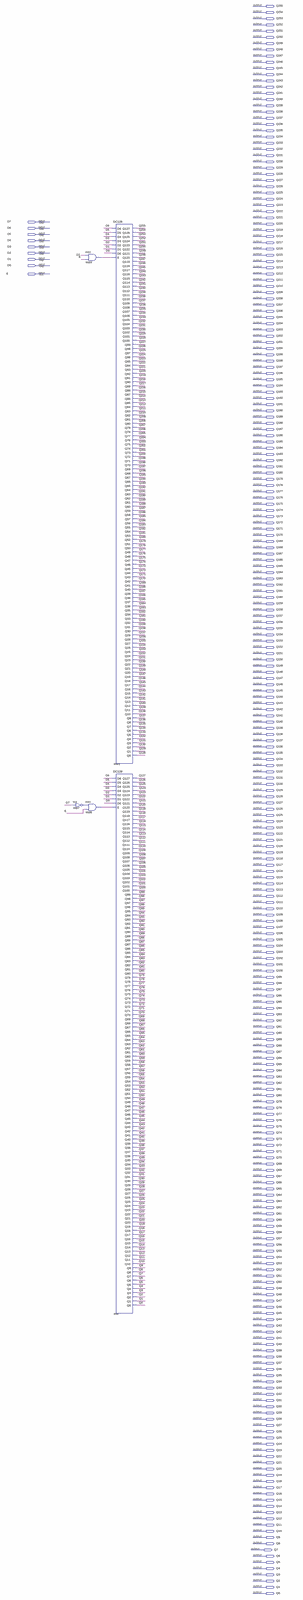
[diagram p0: schematic sheet, whole]
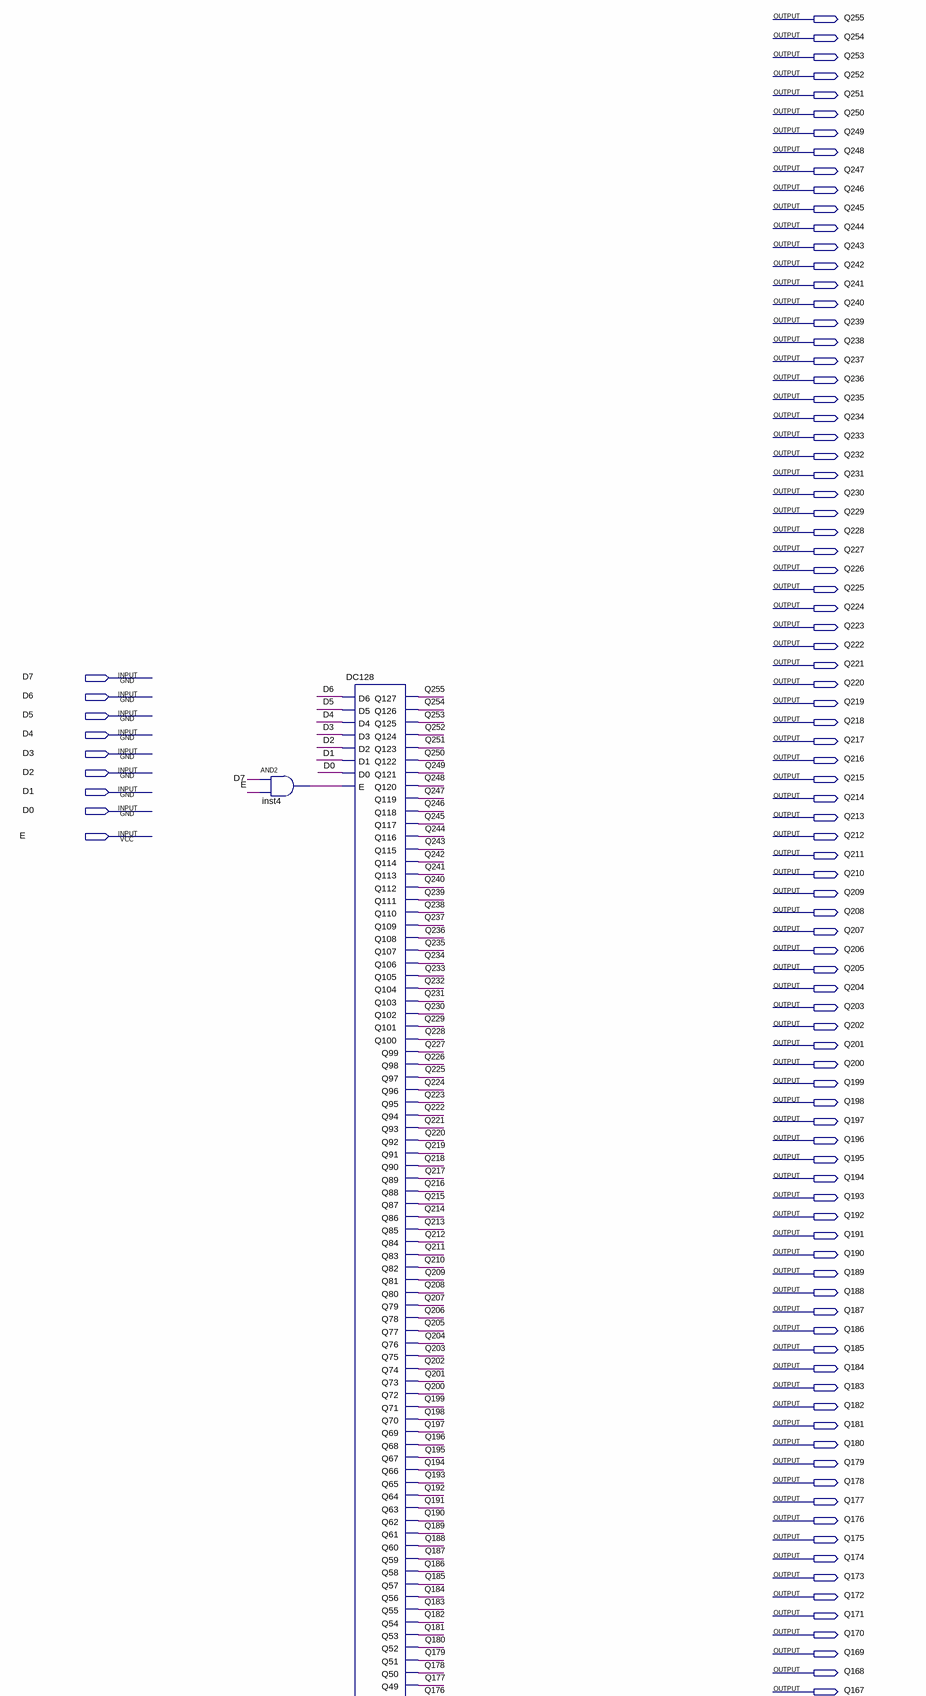
[diagram p1: schematic sheet, upper part]
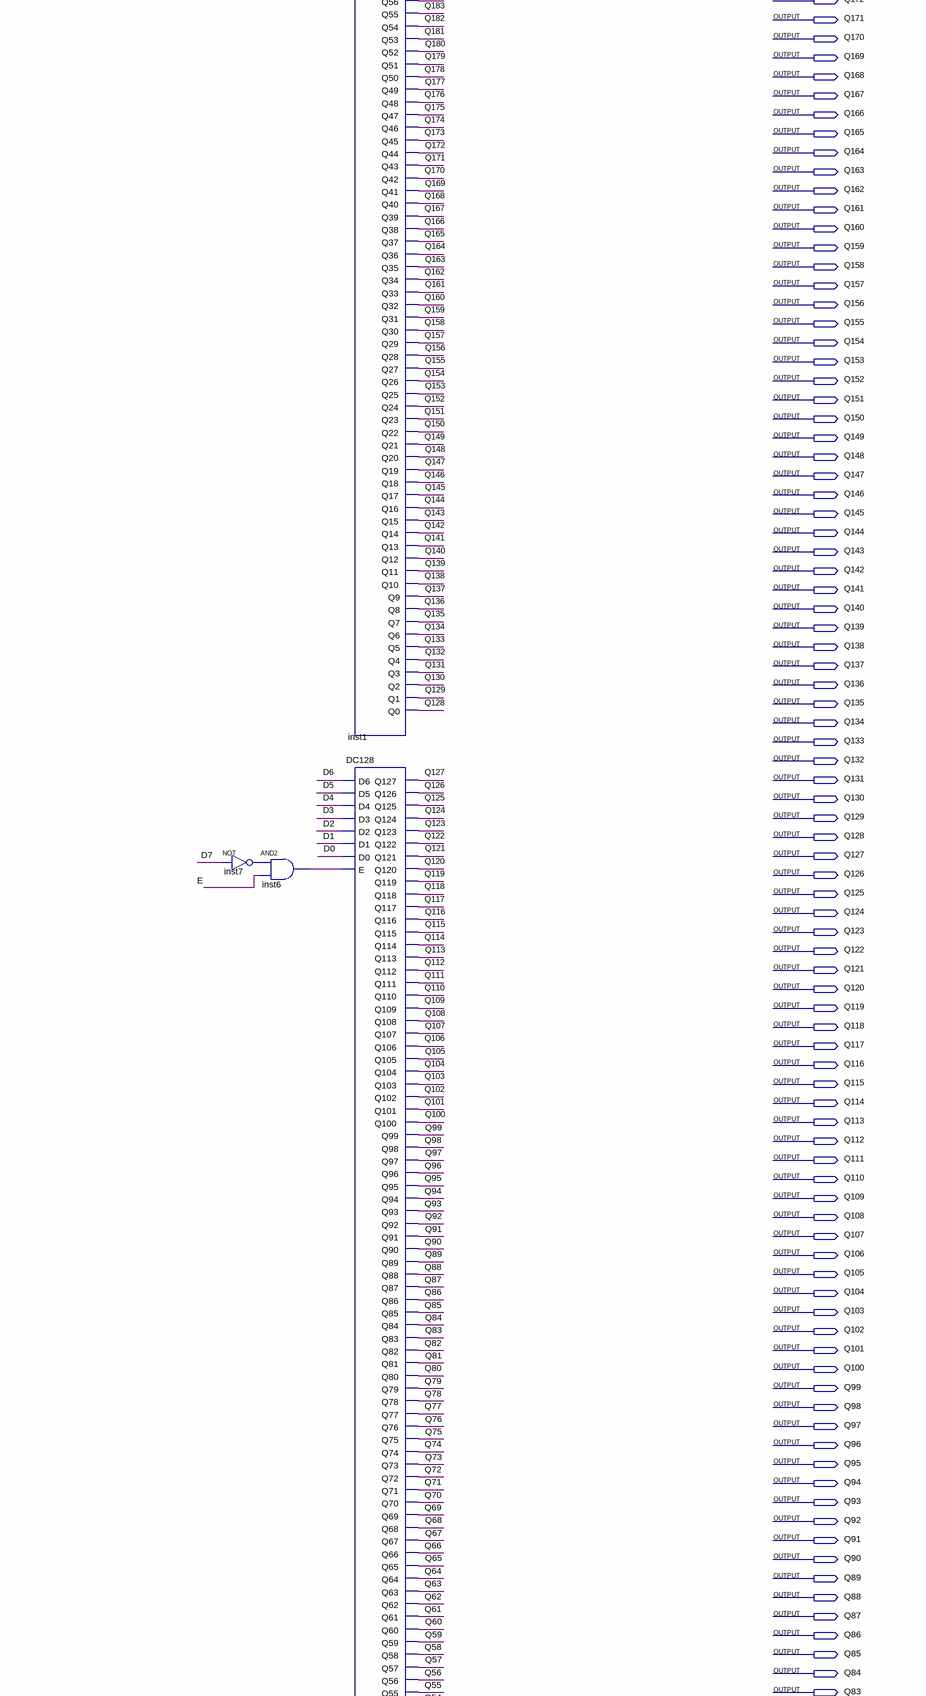
[diagram p2: schematic sheet, middle part]
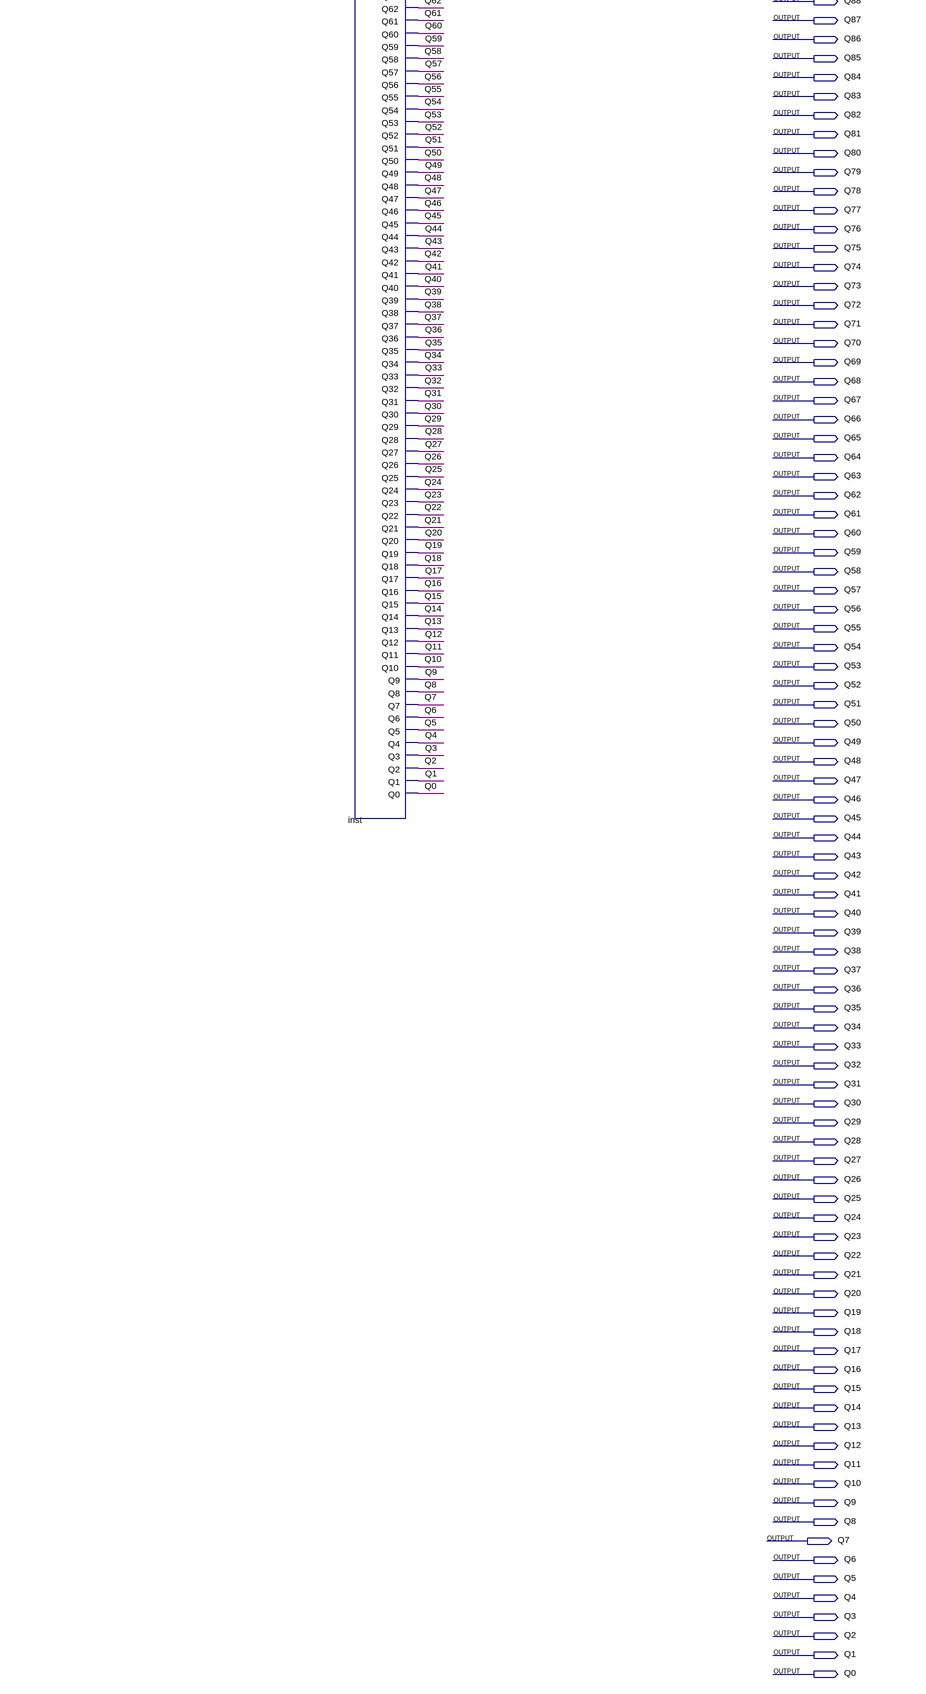
[diagram p3: schematic sheet, lower part]
// Quartus schematic DC256.bdf as structural Verilog: 5 symbols, 265 pins
module DC256 (
  input  D7,
  input  D6,
  input  D5,
  input  D4,
  input  D3,
  input  D2,
  input  D1,
  input  D0,
  input  E,
  output Q255,
  output Q254,
  output Q253,
  output Q252,
  output Q251,
  output Q250,
  output Q249,
  output Q248,
  output Q247,
  output Q246,
  output Q245,
  output Q244,
  output Q243,
  output Q242,
  output Q241,
  output Q240,
  output Q239,
  output Q238,
  output Q237,
  output Q236,
  output Q235,
  output Q234,
  output Q233,
  output Q232,
  output Q231,
  output Q230,
  output Q229,
  output Q228,
  output Q227,
  output Q226,
  output Q225,
  output Q224,
  output Q223,
  output Q222,
  output Q221,
  output Q220,
  output Q219,
  output Q218,
  output Q217,
  output Q216,
  output Q215,
  output Q214,
  output Q213,
  output Q212,
  output Q211,
  output Q210,
  output Q209,
  output Q208,
  output Q207,
  output Q206,
  output Q205,
  output Q204,
  output Q203,
  output Q202,
  output Q201,
  output Q200,
  output Q199,
  output Q198,
  output Q197,
  output Q196,
  output Q195,
  output Q194,
  output Q193,
  output Q192,
  output Q191,
  output Q190,
  output Q189,
  output Q188,
  output Q187,
  output Q186,
  output Q185,
  output Q184,
  output Q183,
  output Q182,
  output Q181,
  output Q180,
  output Q179,
  output Q178,
  output Q177,
  output Q176,
  output Q175,
  output Q174,
  output Q173,
  output Q172,
  output Q171,
  output Q170,
  output Q169,
  output Q168,
  output Q167,
  output Q166,
  output Q165,
  output Q164,
  output Q163,
  output Q162,
  output Q161,
  output Q160,
  output Q159,
  output Q158,
  output Q157,
  output Q156,
  output Q155,
  output Q154,
  output Q153,
  output Q152,
  output Q151,
  output Q150,
  output Q149,
  output Q148,
  output Q147,
  output Q146,
  output Q145,
  output Q144,
  output Q143,
  output Q142,
  output Q141,
  output Q140,
  output Q139,
  output Q138,
  output Q137,
  output Q136,
  output Q135,
  output Q134,
  output Q133,
  output Q132,
  output Q131,
  output Q130,
  output Q129,
  output Q128,
  output Q127,
  output Q126,
  output Q125,
  output Q124,
  output Q123,
  output Q122,
  output Q121,
  output Q120,
  output Q119,
  output Q118,
  output Q117,
  output Q116,
  output Q115,
  output Q114,
  output Q113,
  output Q112,
  output Q111,
  output Q110,
  output Q109,
  output Q108,
  output Q107,
  output Q106,
  output Q105,
  output Q104,
  output Q103,
  output Q102,
  output Q101,
  output Q100,
  output Q99,
  output Q98,
  output Q97,
  output Q96,
  output Q95,
  output Q94,
  output Q93,
  output Q92,
  output Q91,
  output Q90,
  output Q89,
  output Q88,
  output Q87,
  output Q86,
  output Q85,
  output Q84,
  output Q83,
  output Q82,
  output Q81,
  output Q80,
  output Q79,
  output Q78,
  output Q77,
  output Q76,
  output Q75,
  output Q74,
  output Q73,
  output Q72,
  output Q71,
  output Q70,
  output Q69,
  output Q68,
  output Q67,
  output Q66,
  output Q65,
  output Q64,
  output Q63,
  output Q62,
  output Q61,
  output Q60,
  output Q59,
  output Q58,
  output Q57,
  output Q56,
  output Q55,
  output Q54,
  output Q53,
  output Q52,
  output Q51,
  output Q50,
  output Q49,
  output Q48,
  output Q47,
  output Q46,
  output Q45,
  output Q44,
  output Q43,
  output Q42,
  output Q41,
  output Q40,
  output Q39,
  output Q38,
  output Q37,
  output Q36,
  output Q35,
  output Q34,
  output Q33,
  output Q32,
  output Q31,
  output Q30,
  output Q29,
  output Q28,
  output Q27,
  output Q26,
  output Q25,
  output Q24,
  output Q23,
  output Q22,
  output Q21,
  output Q20,
  output Q19,
  output Q18,
  output Q17,
  output Q16,
  output Q15,
  output Q14,
  output Q13,
  output Q12,
  output Q11,
  output Q10,
  output Q9,
  output Q8,
  output Q7,
  output Q6,
  output Q5,
  output Q4,
  output Q3,
  output Q2,
  output Q1,
  output Q0
);

  wire inst4_out, inst6_out, inst7_out;

  and inst4 (inst4_out, D7, E);
  not inst7 (inst7_out, D7);
  and inst6 (inst6_out, inst7_out, E);
  DC128 inst1 (
    .D6(D6), .D5(D5), .D4(D4), .D3(D3), .D2(D2), .D1(D1), .D0(D0), .E(inst4_out), .Q127(Q255), .Q126(Q254),
    .Q125(Q253), .Q124(Q252), .Q123(Q251), .Q122(Q250), .Q121(Q249), .Q120(Q248), .Q119(Q247), .Q118(Q246),
    .Q117(Q245), .Q116(Q244), .Q115(Q243), .Q114(Q242), .Q113(Q241), .Q112(Q240), .Q111(Q239), .Q110(Q238),
    .Q109(Q237), .Q108(Q236), .Q107(Q235), .Q106(Q234), .Q105(Q233), .Q104(Q232), .Q103(Q231), .Q102(Q230),
    .Q101(Q229), .Q100(Q228), .Q99(Q227), .Q98(Q226), .Q97(Q225), .Q96(Q224), .Q95(Q223), .Q94(Q222),
    .Q93(Q221), .Q92(Q220), .Q91(Q219), .Q90(Q218), .Q89(Q217), .Q88(Q216), .Q87(Q215), .Q86(Q214),
    .Q85(Q213), .Q84(Q212), .Q83(Q211), .Q82(Q210), .Q81(Q209), .Q80(Q208), .Q79(Q207), .Q78(Q206),
    .Q77(Q205), .Q76(Q204), .Q75(Q203), .Q74(Q202), .Q73(Q201), .Q72(Q200), .Q71(Q199), .Q70(Q198),
    .Q69(Q197), .Q68(Q196), .Q67(Q195), .Q66(Q194), .Q65(Q193), .Q64(Q192), .Q63(Q191), .Q62(Q190),
    .Q61(Q189), .Q60(Q188), .Q59(Q187), .Q58(Q186), .Q57(Q185), .Q56(Q184), .Q55(Q183), .Q54(Q182),
    .Q53(Q181), .Q52(Q180), .Q51(Q179), .Q50(Q178), .Q49(Q177), .Q48(Q176), .Q47(Q175), .Q46(Q174),
    .Q45(Q173), .Q44(Q172), .Q43(Q171), .Q42(Q170), .Q41(Q169), .Q40(Q168), .Q39(Q167), .Q38(Q166),
    .Q37(Q165), .Q36(Q164), .Q35(Q163), .Q34(Q162), .Q33(Q161), .Q32(Q160), .Q31(Q159), .Q30(Q158),
    .Q29(Q157), .Q28(Q156), .Q27(Q155), .Q26(Q154), .Q25(Q153), .Q24(Q152), .Q23(Q151), .Q22(Q150),
    .Q21(Q149), .Q20(Q148), .Q19(Q147), .Q18(Q146), .Q17(Q145), .Q16(Q144), .Q15(Q143), .Q14(Q142),
    .Q13(Q141), .Q12(Q140), .Q11(Q139), .Q10(Q138), .Q9(Q137), .Q8(Q136), .Q7(Q135), .Q6(Q134), .Q5(Q133),
    .Q4(Q132), .Q3(Q131), .Q2(Q130), .Q1(Q129), .Q0(Q128));
  DC128 inst (
    .D6(D6), .D5(D5), .D4(D4), .D3(D3), .D2(D2), .D1(D1), .D0(D0), .E(inst6_out), .Q127(Q127), .Q126(Q126),
    .Q125(Q125), .Q124(Q124), .Q123(Q123), .Q122(Q122), .Q121(Q121), .Q120(Q120), .Q119(Q119), .Q118(Q118),
    .Q117(Q117), .Q116(Q116), .Q115(Q115), .Q114(Q114), .Q113(Q113), .Q112(Q112), .Q111(Q111), .Q110(Q110),
    .Q109(Q109), .Q108(Q108), .Q107(Q107), .Q106(Q106), .Q105(Q105), .Q104(Q104), .Q103(Q103), .Q102(Q102),
    .Q101(Q101), .Q100(Q100), .Q99(Q99), .Q98(Q98), .Q97(Q97), .Q96(Q96), .Q95(Q95), .Q94(Q94), .Q93(Q93),
    .Q92(Q92), .Q91(Q91), .Q90(Q90), .Q89(Q89), .Q88(Q88), .Q87(Q87), .Q86(Q86), .Q85(Q85), .Q84(Q84),
    .Q83(Q83), .Q82(Q82), .Q81(Q81), .Q80(Q80), .Q79(Q79), .Q78(Q78), .Q77(Q77), .Q76(Q76), .Q75(Q75),
    .Q74(Q74), .Q73(Q73), .Q72(Q72), .Q71(Q71), .Q70(Q70), .Q69(Q69), .Q68(Q68), .Q67(Q67), .Q66(Q66),
    .Q65(Q65), .Q64(Q64), .Q63(Q63), .Q62(Q62), .Q61(Q61), .Q60(Q60), .Q59(Q59), .Q58(Q58), .Q57(Q57),
    .Q56(Q56), .Q55(Q55), .Q54(Q54), .Q53(Q53), .Q52(Q52), .Q51(Q51), .Q50(Q50), .Q49(Q49), .Q48(Q48),
    .Q47(Q47), .Q46(Q46), .Q45(Q45), .Q44(Q44), .Q43(Q43), .Q42(Q42), .Q41(Q41), .Q40(Q40), .Q39(Q39),
    .Q38(Q38), .Q37(Q37), .Q36(Q36), .Q35(Q35), .Q34(Q34), .Q33(Q33), .Q32(Q32), .Q31(Q31), .Q30(Q30),
    .Q29(Q29), .Q28(Q28), .Q27(Q27), .Q26(Q26), .Q25(Q25), .Q24(Q24), .Q23(Q23), .Q22(Q22), .Q21(Q21),
    .Q20(Q20), .Q19(Q19), .Q18(Q18), .Q17(Q17), .Q16(Q16), .Q15(Q15), .Q14(Q14), .Q13(Q13), .Q12(Q12),
    .Q11(Q11), .Q10(Q10), .Q9(Q9), .Q8(Q8), .Q7(Q7), .Q6(Q6), .Q5(Q5), .Q4(Q4), .Q3(Q3), .Q2(Q2), .Q1(Q1),
    .Q0(Q0));
endmodule
